# EasyEDA Pro project 无刷驱动电流闭环控制器.eprj

# Schematic Schematic1
Board Name: Board1; Create Date: 2024-09-18; Page Name: P1; Project Name: 无刷驱动电流闭环控制器; Schematic Name: Schematic1; Update Date: 2025-11-12; Company: 嘉立创EDA; Page Size: A4; Version: V1.0
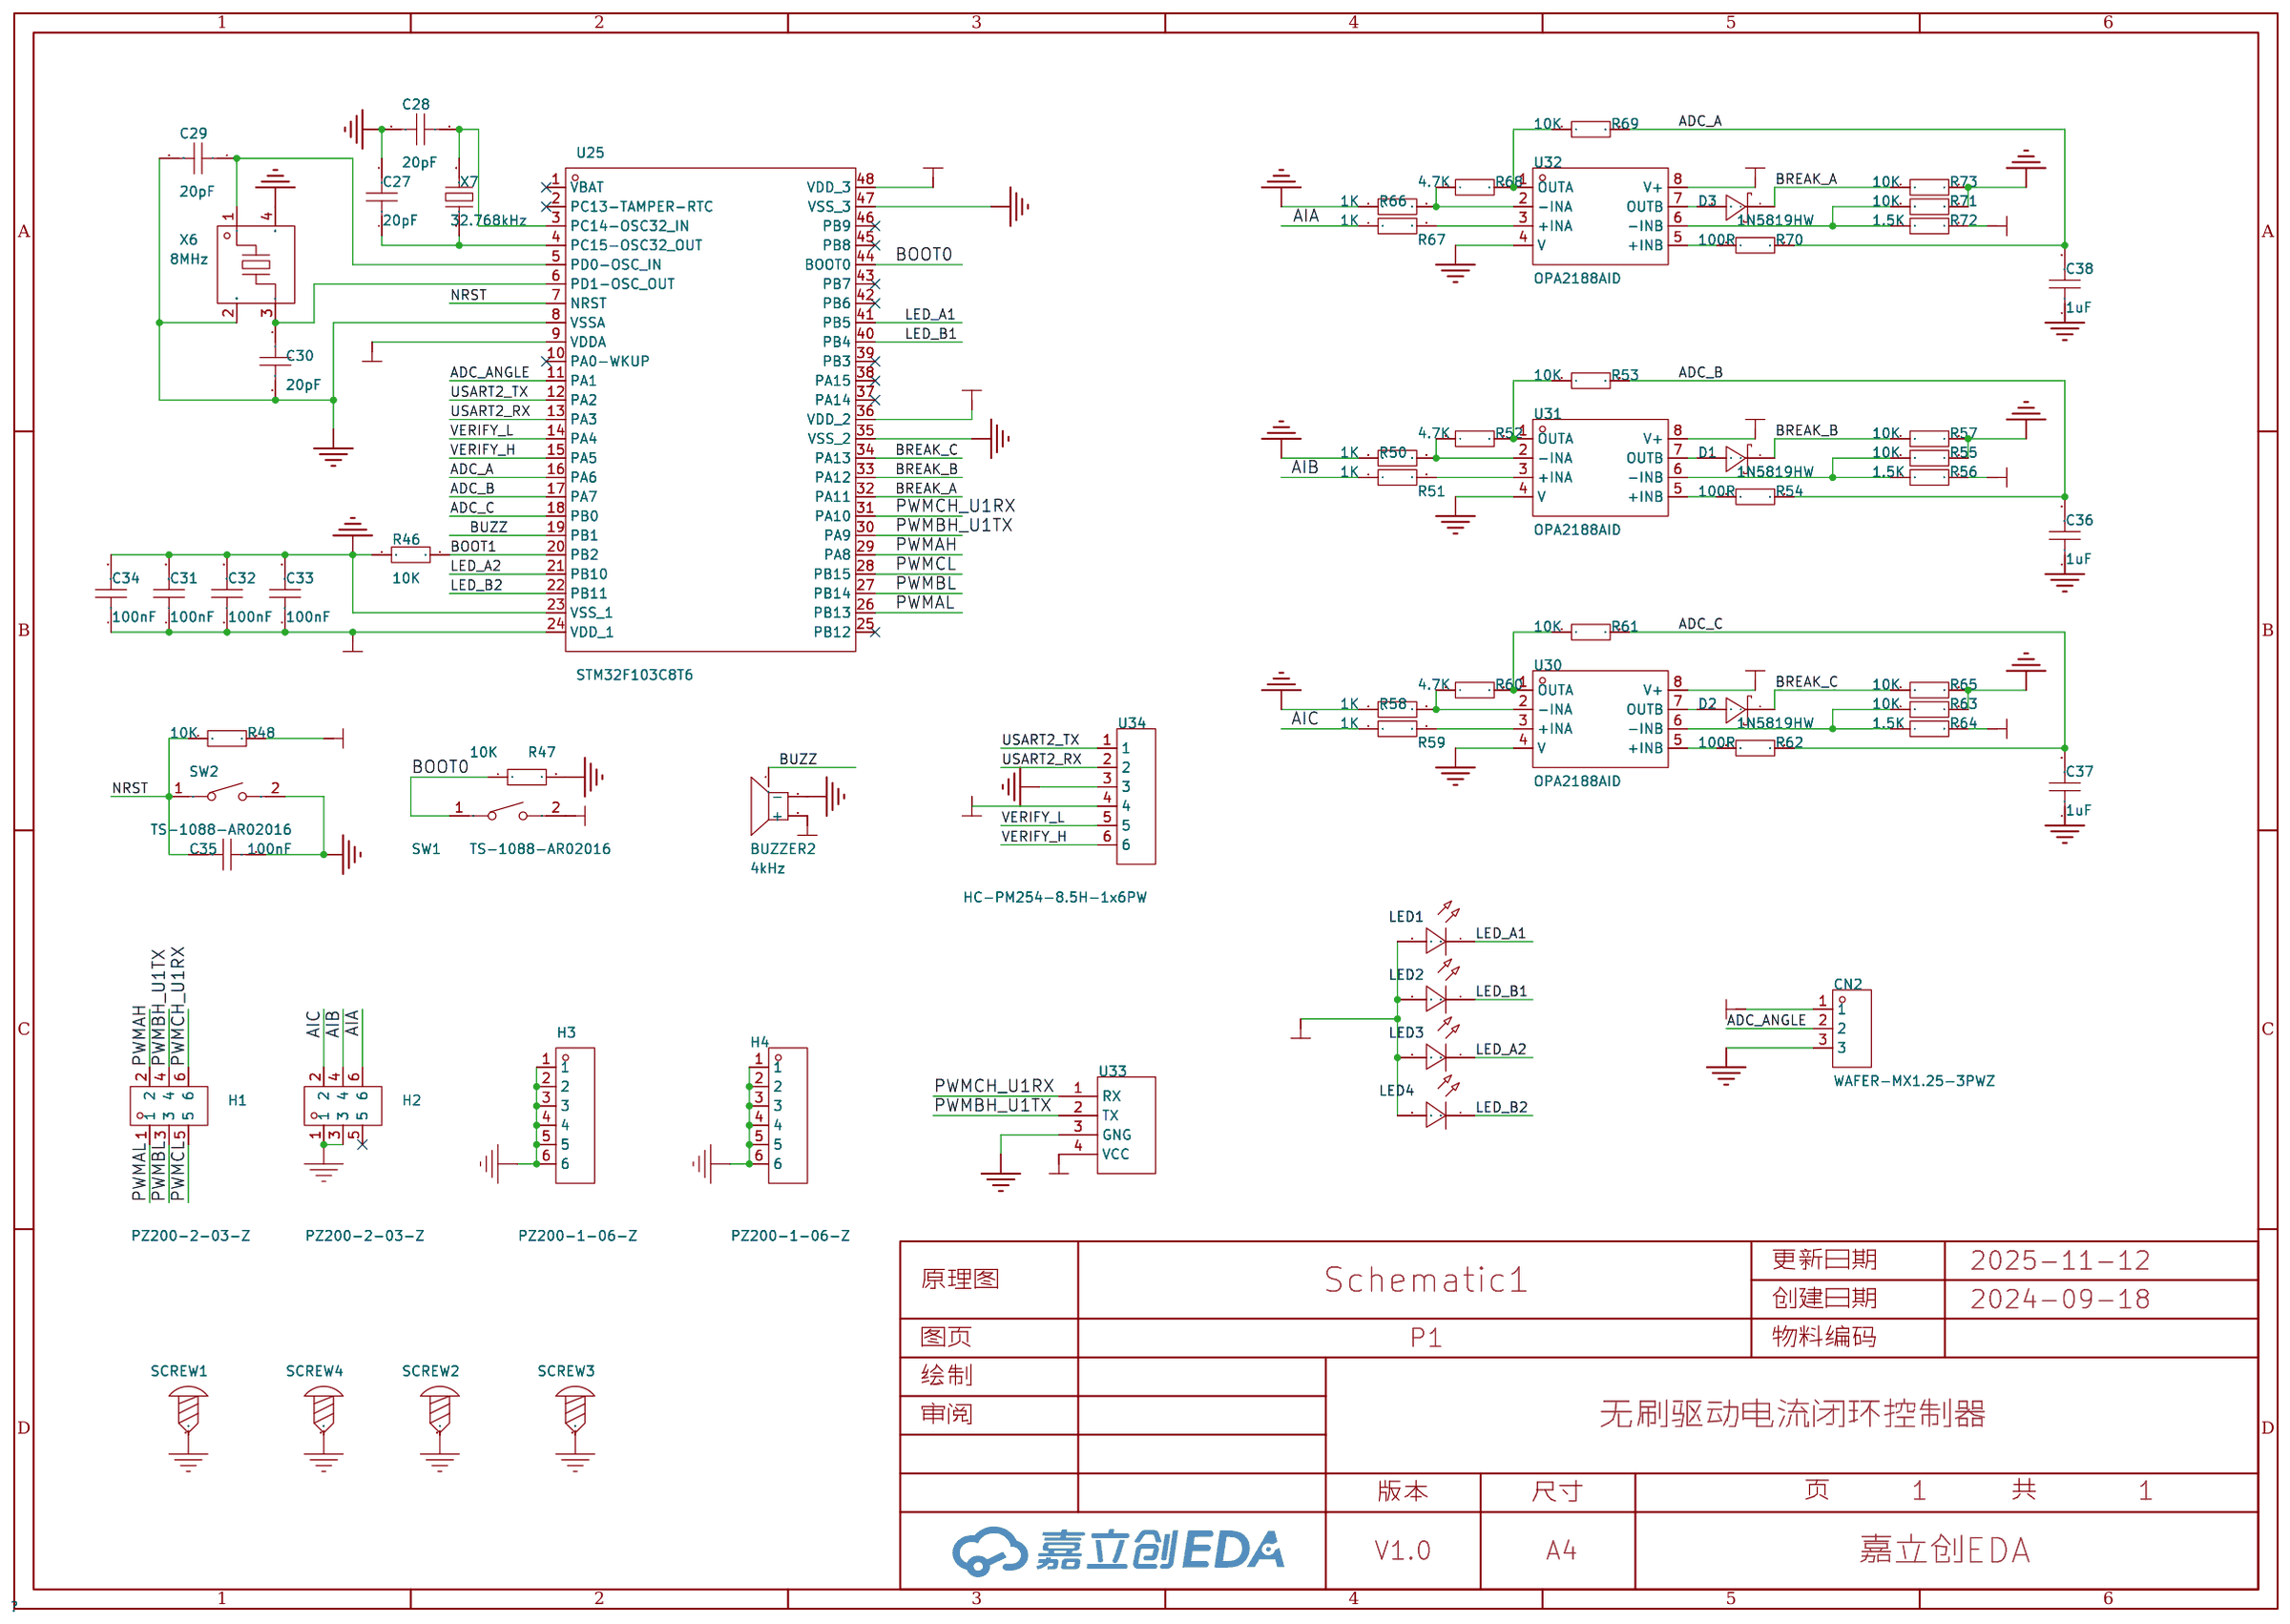
[diagram p0: schematic sheet]

## Parts
BUZZER2  4kHz  [BUZ-SMD_L5.0-W5.5-P4.60]
C27  20pF  [C0402]
C28  20pF  [C0402]
C29  20pF  [C0402]
C30  20pF  [C0402]
C31  100nF  [C0402]
C32  100nF  [C0402]
C33  100nF  [C0402]
C34  100nF  [C0402]
C35  100nF  [C0402]
C36  1uF  [C0402]
C37  1uF  [C0402]
C38  1uF  [C0402]
CN2  WAFER-MX1.25-3PWZ  [CONN-TH_3P-P1.25_XUNPU_WAFER-MX1.25-3PWZ]
D1  1N5819HW  [SOD-123_L2.7-W1.6-LS3.7-RD]
D2  1N5819HW  [SOD-123_L2.7-W1.6-LS3.7-RD]
D3  1N5819HW  [SOD-123_L2.7-W1.6-LS3.7-RD]
H1  PZ200-2-03-Z  [HDR-TH_6P-P2.00-V-M-R2-C3-S2.00]
H2  PZ200-2-03-Z  [HDR-TH_6P-P2.00-V-M-R2-C3-S2.00]
H3  PZ200-1-06-Z  [HDR-TH_6P-P2.00-V-M]
H4  PZ200-1-06-Z  [HDR-TH_6P-P2.00-V-M]
LED1  -  [LED_0402]
LED2  -  [LED_0402]
LED3  -  [LED_0402]
LED4  -  [LED_0402]
R46  10K  [R0402]
R47  10K  [R0402]
R48  10K  [R0402]
R50  1K  [R0402]
R51  1K  [R0402]
R52  4.7K  [R0402]
R53  10K  [R0402]
R54  100R  [R0402]
R55  10K  [R0402]
R56  1.5K  [R0402]
R57  10K  [R0402]
R58  1K  [R0402]
R59  1K  [R0402]
R60  4.7K  [R0402]
R61  10K  [R0402]
R62  100R  [R0402]
R63  10K  [R0402]
R64  1.5K  [R0402]
R65  10K  [R0402]
R66  1K  [R0402]
R67  1K  [R0402]
R68  4.7K  [R0402]
R69  10K  [R0402]
R70  100R  [R0402]
R71  10K  [R0402]
R72  1.5K  [R0402]
R73  10K  [R0402]
SCREW1  -  [M3_BD6.2]
SCREW2  -  [M3_BD6.2]
SCREW3  -  [M3_BD6.2]
SCREW4  -  [M3_BD6.2]
SW1  TS-1088-AR02016  [SW-SMD_L3.9-W3.0-P4.45]
SW2  TS-1088-AR02016  [SW-SMD_L3.9-W3.0-P4.45]
U25  STM32F103C8T6  [LQFP-48_L7.0-W7.0-P0.50-LS9.0-BL]
U30  OPA2188AID  [SOIC-8_L4.9-W3.9-P1.27-LS6.0-BL]
U31  OPA2188AID  [SOIC-8_L4.9-W3.9-P1.27-LS6.0-BL]
U32  OPA2188AID  [SOIC-8_L4.9-W3.9-P1.27-LS6.0-BL]
U33  -  [2.54串口烧录接口]
U34  HC-PM254-8.5H-1x6PW  [HDR-TH_HC-PM254-8.5H-1X6PW]
X6  8MHz  [OSC-SMD_4P-L3.2-W2.5-BL]
X7  32.768kHz  [OSC-SMD_L3.2-W1.5]

## Library data of the parts
BUZZER2 = MLT-5020: Supplier Part: C94598; Manufacturer: 华能; Supplier Footprint: SMD,5x5mm; JLCPCB Part Class: 扩展库; Datasheet: https://item.szlcsc.com/datasheet/MLT-5020/95796.html; Supplier: LCSC; Driver Circuitry: 无源(外部驱动); Technology: 电磁式; Length: 5.2mm; Width: 5.2mm; Height: 2.5mm
C27-C38 = CAP_0402: Supplier Footprint: 0402
CN2 = WAFER-MX1.25-3PWZ: 间距:1.25mm;插针结构:1x3P;排数:1;每排PIN数:3;公母:公型插针;安装方式:弯插;额定电流:1A;工作温度范围:-25℃~+85℃;; LCSC Part Name: 1.25mm 1x3P 弯插; Supplier Part: C3029405; Manufacturer: XUNPU(讯普); Supplier Footprint: 弯插,P=1.25mm; JLCPCB Part Class: 扩展库; Datasheet: https://atta.szlcsc.com/upload/public/pdf/source/20220527/86F7067D82B0B41BBD7A4713D9D828E9.pdf; Supplier: LCSC; Pitch: 1.25mm; Pins Structure: 1x3P; Number of Rows: 1; Number of PINs Per Row: 3; Gender: 公型插针; Mounting Style: 弯插; Current Rating (Max): 1A; Operating Temperature Range: -25℃~+85℃
D1-D3 = 1N5819HW-7-F: LCSC Part Name: 电压:40V 电流:1A; Supplier Part: C82544; Manufacturer: DIODES(美台); Supplier Footprint: SOD-123; JLCPCB Part Class: 扩展库; Datasheet: https://atta.szlcsc.com/upload/public/pdf/source/20161024/1477288459223.pdf; Supplier: LCSC; Forward Voltage (Vf@If): 450mV@1A; Reverse Voltage (Vr): 40V; Rectified Current: 1A; Reverse Leakage Current (Ir): 1mA@40V
H1 H2 = PZ200-2-03-Z: LCSC Part Name: 2x3P 间距:2mm 方针 直插; Supplier Part: C2905989; Manufacturer: HCTL(华灿天禄); Supplier Footprint: 插件,P=2mm; JLCPCB Part Class: 扩展库; Datasheet: https://atta.szlcsc.com/upload/public/pdf/source/20230609/E9B292E9F4F82C2859D5665FE1B563FB.pdf; Supplier: LCSC; Pin Structure: 2x3P; Pitch: 2mm; Row Spacing: 2mm; Circluar Pins/Square Pins: 方针; Mounting Type: 直插; Number of Rows: 双排; Number of Pins: 6P; Current Rating (Max): 1.5A; Length of Mating Pin: 4mm; Insulation Height: 2mm; Length of End Connection Pin: 2.8mm; Contact Material: 黄铜; Operating Temperature Range: -40℃~+105℃; Soldering Temperature(Max): 260℃@5S; Color: 黑色
H3 H4 = PZ200-1-06-Z: LCSC Part Name: 1x6P 间距:2mm 方针 直插; Supplier Part: C2905952; Manufacturer: HCTL(华灿天禄); Supplier Footprint: 插件,P=2mm; JLCPCB Part Class: 扩展库; Datasheet: https://atta.szlcsc.com/upload/public/pdf/source/20230609/0DA0371628951EEB327252501352EB23.pdf; Supplier: LCSC; Pin Structure: 1x6P; Pitch: 2mm; Circluar Pins/Square Pins: 方针; Mounting Type: 直插; Number of Rows: 单排; Number of Pins: 6P; Current Rating (Max): 1.5A; Length of Mating Pin: 4mm; Insulation Height: 2mm; Length of End Connection Pin: 2.8mm; Contact Material: 黄铜; Operating Temperature Range: -40℃~+105℃; Soldering Temperature(Max): 260℃@5S; Color: 黑色
LED1-LED4 = LED_0402-G: Supplier Footprint: 0402
R46-R48 R50-R73 = Res_0402: Supplier Footprint: 0402
SCREW1-SCREW4 = M3螺丝: Supplier Footprint: 插件
SW1 SW2 = TS-1088-AR02016: LCSC Part Name: 4*3*2mm 立贴 轻触开关; Supplier Part: C720477; Manufacturer: XUNPU(讯普); Supplier Footprint: SMD; JLCPCB Part Class: 扩展库; Datasheet: https://atta.szlcsc.com/upload/public/pdf/source/20200810/C720475_60D09DD6C54279ADDB2DC25100F1CC11.pdf; Supplier: LCSC; Circuit: 单刀单掷; Actuator Style: 圆形按钮; Operating Force: 160gf; Mounting Style: 立贴; Switch Length: 4mm; Switch Width: 3mm; Switch Height: 2mm; Strike Gundam: 不带; Contact Current: 50mA; Voltage Rating (DC): 12V; Insulation Resistance: 100MΩ; Actuator/Cap Color: 黑色; Pin Style: SMD接片; Mechanical Life: 10万次; Operating Temperature: -30℃~+80℃
U25 = STM32F103C8T6: LCSC Part Name: 主流增强型ARM Cortex-M3 MCU，具有64 KB Flash、72 MHz CPU、电机控制、USB和CAN; Supplier Part: C8734; Manufacturer: ST(意法半导体); Supplier Footprint: LQFP-48(7x7); JLCPCB Part Class: 扩展库; Datasheet: https://atta.szlcsc.com/upload/public/pdf/source/20220812/8363ACEC51AD55ECEB84799464F7CB85.pdf; Supplier: LCSC; CPU Core: ARM-M3; CPU Maximum Speed: 72MHz; Program Storage Size: 64KB; Program Memory Type: FLASH; GPIO Ports Number: 37; ADC (Bit): 12bit; Low Voltage Detection Threshold: 2V~3.6V
U30-U32 = OPA2188AID: Supplier Part: C2865878; Manufacturer: TI(德州仪器); Supplier Footprint: SOIC-8; JLCPCB Part Class: 扩展库; Datasheet: https://www.ti.com/cn/lit/gpn/opa2188; Supplier: LCSC; Number of Circuits: 双路; Gain Bandwidth Product(GBP): 2MHz; Current - Input Bias(Ib): 160pA; Voltage - Input Offset(Vos): 6uV; Slew Rate(SR): 0.8V/us; Operating Temperature: -40℃~+105℃
U33 = 2.54串口烧录接口
U34 = HC-PM254-8.5H-1x6PW: LCSC Part Name: 间距2.54mm 1x6Pin 弯插 PC3.2 PB10.2 H8.5; Supplier Part: C22436147; Manufacturer: HC(虹成电子); Supplier Footprint: 弯插,P=2.54mm; JLCPCB Part Class: 扩展库; Datasheet: https://item.szlcsc.com/datasheet/HC-PM254-8.5H-1x6PW/24066823.html; Supplier: LCSC; Holes Structure: 1x6P; Pitch: 2.54mm; Circular Hole / Square Hole: 方孔; Mounting Type: 弯插; Number of Rows: 单排; Number of Positions: 6P; Current Rating: 3A; Holes Direction: 侧面; Insulation Height: 2.5mm; Contact Material: 黄铜; Contact Plating: 金; Operating Temperature: -40℃~+105℃; PIN Length: 3mm
X6 = X32258MOB4SI: 晶振类型:贴片无源晶振;频率:8MHz;常温频差:±10ppm;负载电容:12pF;频率稳定度(全温):±30ppm;; LCSC Part Name: 8MHz ±10ppm 12pF; Supplier Part: C2682775; Manufacturer: YXC(扬兴晶振); Supplier Footprint: SMD3225-4P; JLCPCB Part Class: 扩展库; Datasheet: https://atta.szlcsc.com/upload/public/pdf/source/20210106/C2682774_0CD4FDA5D9DA3FBEEC23BD607A48E4B0.pdf; Supplier: LCSC; Crystal Type: 贴片无源晶振; Normal temperature Frequency Tolerance: ±10ppm; Load Capacitance: 12pF; Frequency Stability(Full temperature range): ±30ppm; Equivalent Series Resistance (ESR): 150Ω; Operating Temperature: -40℃~+85℃
X7 = X321532768KGD2SI: 频率:32.768kHz;负载电容:12.5pF;频率公差:±20ppm;; LCSC Part Name: 32.768kHz ±20ppm 12.5pF YST310S; Supplier Part: C620155; Manufacturer: YXC(扬兴晶振); Supplier Footprint: SMD3215-2P; Datasheet: https://atta.szlcsc.com/upload/public/pdf/source/20210329/C620155_E5A74FC0D27C5E9015A8D75DE9484FEA.pdf; Supplier: LCSC; Crystal Type: 贴片无源晶振; Load Capacitance: 12.5pF; Frequency Tolerance: ±20ppm; Operating Temperature: -40℃~+85℃

## Nets
3V3: BUZZER2.1(+) C31.1 C32.1 C33.1 C34.1 CN2.1 LED1.2(A) LED2.2(A) LED3.2(A) LED4.2(A) R48.2 R56.2 R64.2 R72.2 SW1.2 U25.9(VDDA) U25.24(VDD_1) U25.36(VDD_2) U25.48(VDD_3) U30.8(V+) U31.8(V+) U32.8(V+) U33.4(VCC) U34.4
GND: BUZZER2.2(-) C27.2 C28.2 C29.2 C30.2 C31.2 C32.2 C33.2 C34.2 C35.2 C36.1 C37.1 C38.1 CN2.3 H2.1 H2.3 H3.1 H3.2 H3.3 H3.4 H3.5 H3.6 H4.1 H4.2 H4.3 H4.4 H4.5 H4.6 R46.2 R47.2 R50.1 R55.2 R57.2 R58.1 R63.2 R65.2 R66.1 R71.2 R73.2 SCREW1.1 SCREW2.1 SCREW3.1 SCREW4.1 SW2.2 U25.8(VSSA) U25.23(VSS_1) U25.35(VSS_2) U25.47(VSS_3) U30.4(V) U31.4(V) U32.4(V) U33.3(GNG) U34.3 X6.2(GND) X6.4(GND)
ADC_A: C38.2 R69.2 R70.2 U25.16(PA6)
ADC_ANGLE: CN2.2 U25.11(PA1)
ADC_B: C36.2 R53.2 R54.2 U25.17(PA7)
ADC_C: C37.2 R61.2 R62.2 U25.18(PB0)
AIA: H2.6 R67.1
AIB: H2.4 R51.1
AIC: H2.2 R59.1
BOOT0: R47.1 SW1.1 U25.44(BOOT0)
BOOT1: R46.1 U25.20(PB2)
BREAK_A: D3.1(K) R73.1 U25.32(PA11)
BREAK_B: D1.1(K) R57.1 U25.33(PA12)
BREAK_C: D2.1(K) R65.1 U25.34(PA13)
BUZZ: BUZZER2.3(NC) U25.19(PB1)
LED_A1: LED1.1(C) U25.41(PB5)
LED_A2: LED3.1(C) U25.21(PB10)
LED_B1: LED2.1(C) U25.40(PB4)
LED_B2: LED4.1(C) U25.22(PB11)
NRST: C35.1 R48.1 SW2.1 U25.7(NRST)
PWMAH: H1.2 U25.29(PA8)
PWMAL: H1.1 U25.26(PB13)
PWMBH_U1TX: H1.4 U25.30(PA9) U33.2(TX)
PWMBL: H1.3 U25.27(PB14)
PWMCH_U1RX: H1.6 U25.31(PA10) U33.1(RX)
PWMCL: H1.5 U25.28(PB15)
USART2_RX: U25.13(PA3) U34.2
USART2_TX: U25.12(PA2) U34.1
VERIFY_H: U25.15(PA5) U34.6
VERIFY_L: U25.14(PA4) U34.5
$1N3127: C27.1 U25.4(PC15-OSC32_OUT) X7.1
$1N3130: C28.1 U25.3(PC14-OSC32_IN) X7.2
$1N3131: C29.1 U25.5(PD0-OSC_IN) X6.1
$1N3136: C30.1 U25.6(PD1-OSC_OUT) X6.3
$1N4212: R51.2 U31.3(+INA)
$1N4216: R50.2 R52.1 U31.2(-INA)
$1N4220: R52.2 R53.1 U31.1(OUTA)
$1N4300: R54.1 U31.5(+INB)
$1N4502: R55.1 R56.1 U31.6(-INB)
$1N4584: D1.2(A) U31.7(OUTB)
$1N5057: R59.2 U30.3(+INA)
$1N5059: R58.2 R60.1 U30.2(-INA)
$1N5062: R60.2 R61.1 U30.1(OUTA)
$1N5070: R62.1 U30.5(+INB)
$1N5074: R63.1 R64.1 U30.6(-INB)
$1N5079: D2.2(A) U30.7(OUTB)
$1N5487: R67.2 U32.3(+INA)
$1N5489: R66.2 R68.1 U32.2(-INA)
$1N5492: R68.2 R69.1 U32.1(OUTA)
$1N5500: R70.1 U32.5(+INB)
$1N5504: R71.1 R72.1 U32.6(-INB)
$1N5509: D3.2(A) U32.7(OUTB)

Not connected (* = marked no-connect by the designer): H2 5*; U25 1(VBAT)* 2(PC13-TAMPER-RTC)* 10(PA0-WKUP)* 25(PB12)* 37(PA14)* 38(PA15)* 39(PB3)* 42(PB6)* 43(PB7)* 45(PB8)* 46(PB9)*

# Board PCB1
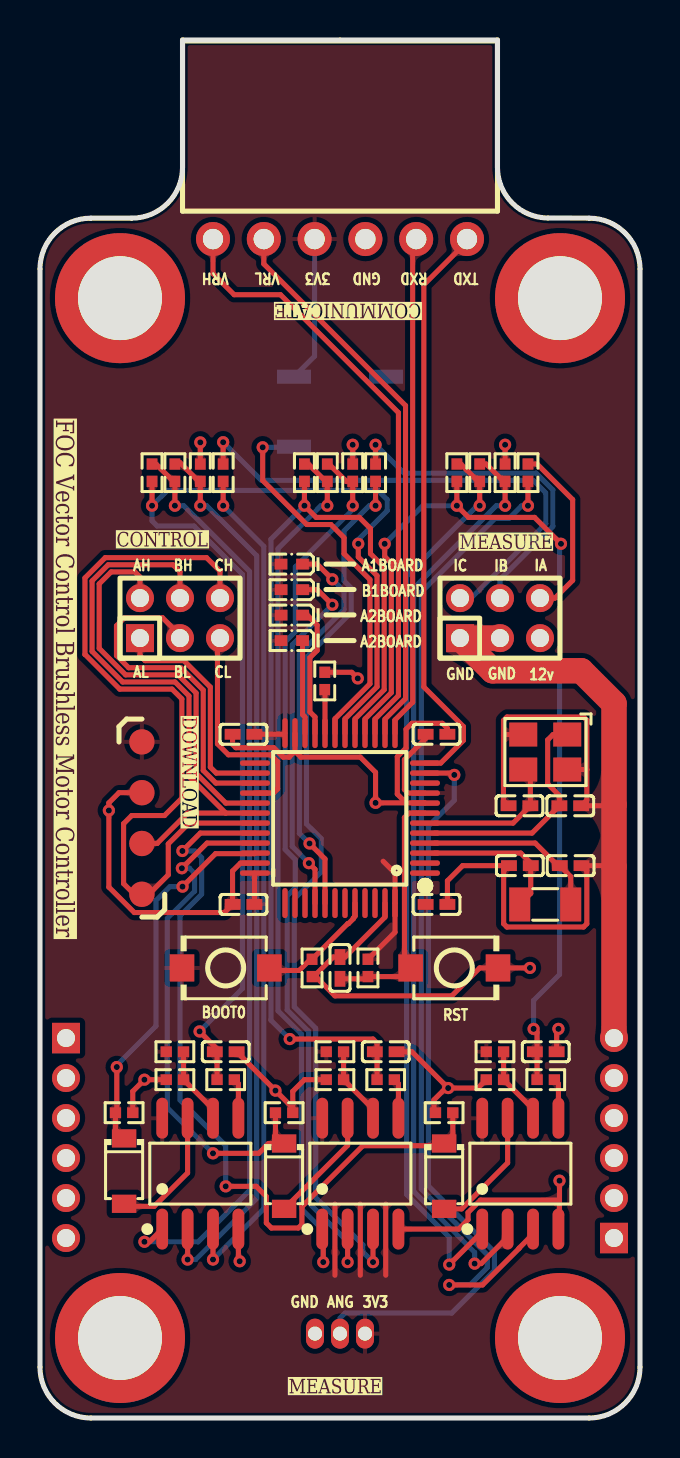
[diagram p1: board, top side]
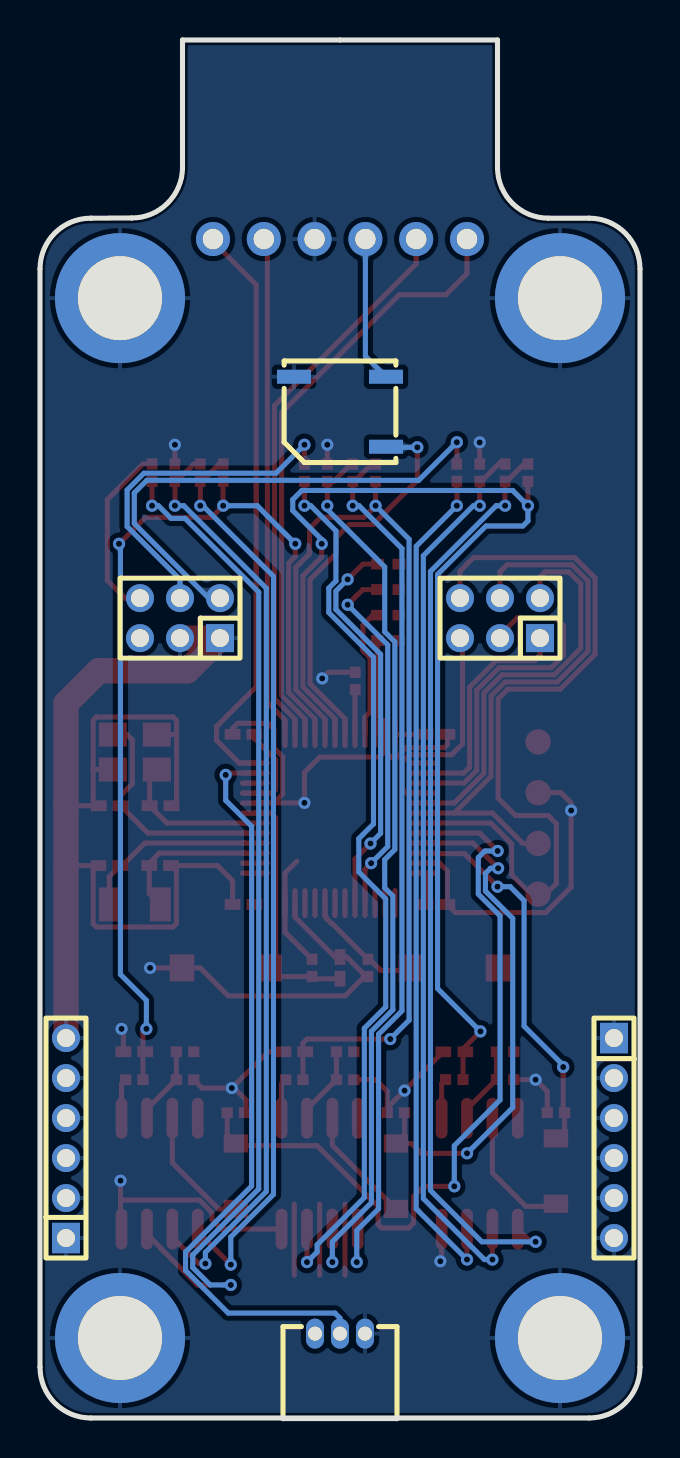
[diagram p2: board, bottom side, seen from below]

Outline 30 x 68.91 mm; copper layers: Top Layer, Bottom Layer. Coordinates in mm from the lower left corner of the outline.
Outline path: 0,57.46 0,2.54 arc(0.74,0.74) 2.54,0 27.46,0 arc(29.26,0.74) 30,2.54 30,57.46 arc(29.26,59.26) 27.46,60 25.41,60.01 arc(23.63,60.74) 22.87,62.52 22.87,68.91 7.13,68.91 7.13,62.53 arc(6.38,60.74) 4.59,60 2.54,60 arc(0.74,59.26) 0,57.46
Stack: Top Layer 0.035mm / Dielectric1 1.51mm FR4 er 4.5 / Bottom Layer 0.035mm

## Design rules (mm)
template: JLCPCB Capability(Two Layers Board)
spacing copperThickness1oz (default): track to track 0.102, other pairs 0.152 to 0.3
spacing copperThickness2oz: track to track 0.203, other pairs 0.152 to 0.3
track width copperThickness1oz (default): min 0.127, default 0.254, max 2.54
track width copperThickness2oz: min 0.203, default 0.254, max 2.54
differential pair differentialPair (default): width min 0.127, default 0.254, max 2.54; gap min 0.152, default 0.152
via viaSize (default): diameter min 0.5, default 0.61, max 10; hole min 0.3, default 0.305, max 6.3

## Placement (name value [footprint] x y rotation side)
BUZZER2  4kHz  [BUZ-SMD_L5.0-W5.5-P4.60]  15 50.32 0 bottom
C27  20pF  [C0402]  26.53 27.62 0 top
C28  20pF  [C0402]  23.99 27.62 180 top
C29  20pF  [C0402]  26.51 30.62 0 top
C30  20pF  [C0402]  23.97 30.62 180 top
C31  100nF  [C0402]  10.17 34.19 180 top
C32  100nF  [C0402]  19.83 34.19 0 top
C33  100nF  [C0402]  19.83 25.68 0 top
C34  100nF  [C0402]  10.17 25.68 180 top
C35  100nF  [C0402]  15 22.51 90 top
C36  1uF  [C0402]  17.29 18.32 180 top
C37  1uF  [C0402]  9.28 18.32 180 top
C38  1uF  [C0402]  25.29 18.32 180 top
CN2  WAFER-MX1.25-3PWZ  [CONN-TH_3P-P1.25_XUNPU_WAFER-MX1.25-3PWZ]  15 4.22 180 bottom
D1  1N5819HW  [SOD-123_L2.7-W1.6-LS3.7-RD]  12.21 12.09 270 top
D2  1N5819HW  [SOD-123_L2.7-W1.6-LS3.7-RD]  4.21 12.35 270 top
D3  1N5819HW  [SOD-123_L2.7-W1.6-LS3.7-RD]  20.21 12.09 270 top
H1  PZ200-2-03-Z  [HDR-TH_6P-P2.00-V-M-R2-C3-S2.00]  7 40 180 bottom
H2  PZ200-2-03-Z  [HDR-TH_6P-P2.00-V-M-R2-C3-S2.00]  23 40 180 bottom
H3  PZ200-1-06-Z  [HDR-TH_6P-P2.00-V-M]  1.3 14 270 bottom
H4  PZ200-1-06-Z  [HDR-TH_6P-P2.00-V-M]  28.7 14 90 bottom
LED1  -  [LED_0402]  12.59 42.7 180 top
LED2  -  [LED_0402]  12.59 41.42 180 top
LED3  -  [LED_0402]  12.59 40.15 180 top
LED4  -  [LED_0402]  12.59 38.88 180 top
R46  10K  [R0402]  14.24 36.86 90 top
R47  10K  [R0402]  13.6 22.51 270 top
R48  10K  [R0402]  16.4 22.51 90 top
R50  1K  [R0402]  15.63 47.27 270 top
R51  1K  [R0402]  16.78 47.27 270 top
R52  4.7K  [R0402]  14.37 47.27 270 top
R53  10K  [R0402]  13.22 47.27 270 top
R54  100R  [R0402]  17.29 16.92 180 top
R55  10K  [R0402]  14.75 16.92 180 top
R56  1.5K  [R0402]  14.75 18.32 180 top
R57  10K  [R0402]  12.21 15.27 0 top
R58  1K  [R0402]  8.01 47.27 270 top
R59  1K  [R0402]  9.16 47.27 270 top
R60  4.7K  [R0402]  6.75 47.27 270 top
R61  10K  [R0402]  5.6 47.27 270 top
R62  100R  [R0402]  9.28 16.92 180 top
R63  10K  [R0402]  6.75 16.92 180 top
R64  1.5K  [R0402]  6.75 18.32 180 top
R65  10K  [R0402]  4.21 15.27 0 top
R66  1K  [R0402]  23.25 47.27 270 top
R67  1K  [R0402]  24.4 47.27 270 top
R68  4.7K  [R0402]  21.99 47.27 270 top
R69  10K  [R0402]  20.84 47.27 270 top
R70  100R  [R0402]  25.29 16.92 180 top
R71  10K  [R0402]  22.75 16.92 180 top
R72  1.5K  [R0402]  22.75 18.32 180 top
R73  10K  [R0402]  20.21 15.27 180 top
SCREW1  -  [M3_BD6.2]  4 4 0 top
SCREW2  -  [M3_BD6.2]  26 56 0 top
SCREW3  -  [M3_BD6.2]  26 4 0 top
SCREW4  -  [M3_BD6.2]  4 56 0 top
SW1  TS-1088-AR02016  [SW-SMD_L3.9-W3.0-P4.45]  9.28 22.51 180 top
SW2  TS-1088-AR02016  [SW-SMD_L3.9-W3.0-P4.45]  20.72 22.51 0 top
U25  STM32F103C8T6  [LQFP-48_L7.0-W7.0-P0.50-LS9.0-BL]  15 30 90 top
U30  OPA2188AID  [SOIC-8_L4.9-W3.9-P1.27-LS6.0-BL]  8.01 12.22 0 top
U31  OPA2188AID  [SOIC-8_L4.9-W3.9-P1.27-LS6.0-BL]  16.02 12.22 0 top
U32  OPA2188AID  [SOIC-8_L4.9-W3.9-P1.27-LS6.0-BL]  24.02 12.22 0 top
U33  -  [2.54串口烧录接口]  5.09 30 90 top
U34  HC-PM254-8.5H-1x6PW  [HDR-TH_HC-PM254-8.5H-1X6PW]  15 58.96 180 top
X6  8MHz  [OSC-SMD_4P-L3.2-W2.5-BL]  25.26 33.3 180 top
X7  32.768kHz  [OSC-SMD_L3.2-W1.5]  25.26 25.68 180 top

## Footprints (pads in the part's own frame, mm; a bottom-side part is the same pattern mirrored in y, then rotated)
2.54串口烧录接口
  round 1.27 smd: 1(-3.81,0) 2(-1.27,0) 3(1.27,0) 4(3.81,0)
BUZ-SMD_L5.0-W5.5-P4.60
  rect 1.7x0.7 smd: 1(-2.3,-1.75) 2(2.3,-1.75) 3(-2.3,1.75)
C0402
  rect 0.79x0.54 smd: 1(-0.545,0) 2(0.545,0)
CONN-TH_3P-P1.25_XUNPU_WAFER-MX1.25-3PWZ
  oval 0.9x1.5 hole 0.7: 1(-1.25,0) 2(0,0) 3(1.25,0)
HDR-TH_6P-P2.00-V-M
  rect 1.524x1.4 hole 0.9: 1(-5,0)
  round 1.4 hole 0.9: 2(-3,0) 3(-1,0) 4(1,0) 5(3,0) 6(5,0)
HDR-TH_6P-P2.00-V-M-R2-C3-S2.00
  rect 1.4x1.4 hole 0.9: 1(2,-1)
  round 1.4 hole 0.9: 2(2,1) 3(0,-1) 4(0,1) 5(-2,-1) 6(-2,1)
HDR-TH_HC-PM254-8.5H-1X6PW
  round 1.7 hole 1.02: 1(-6.35,0) 2(-3.81,0) 3(-1.27,0) 4(1.27,0) 5(3.81,0) 6(6.35,0)
LED_0402
  rect 0.637x0.541 smd: 1(-0.538,0) 2(0.538,0)
LQFP-48_L7.0-W7.0-P0.50-LS9.0-BL
  oval 0.27x1.5 smd: 1(-2.75,-4.25) 2(-2.25,-4.25) 3(-1.75,-4.25) 4(-1.25,-4.25) 5(-0.75,-4.25) 6(-0.25,-4.25) 7(0.25,-4.25) 8(0.75,-4.25) 9(1.25,-4.25) 10(1.75,-4.25) 11(2.25,-4.25) 12(2.75,-4.25) 25(2.75,4.25) 26(2.25,4.25) 27(1.75,4.25) 28(1.25,4.25) 29(0.75,4.25) 30(0.25,4.25) 31(-0.25,4.25) 32(-0.75,4.25) 33(-1.25,4.25) 34(-1.75,4.25) 35(-2.25,4.25) 36(-2.75,4.25)
  oval 1.5x0.27 smd: 13(4.25,-2.75) 14(4.25,-2.25) 15(4.25,-1.75) 16(4.25,-1.25) 17(4.25,-0.75) 18(4.25,-0.25) 19(4.25,0.25) 20(4.25,0.75) 21(4.25,1.25) 22(4.25,1.75) 23(4.25,2.25) 24(4.25,2.75) 37(-4.25,2.75) 38(-4.25,2.25) 39(-4.25,1.75) 40(-4.25,1.25) 41(-4.25,0.75) 42(-4.25,0.25) 43(-4.25,-0.25) 44(-4.25,-0.75) 45(-4.25,-1.25) 46(-4.25,-1.75) 47(-4.25,-2.25) 48(-4.25,-2.75)
M3_BD6.2
  round 6.5 hole 4.2: 1(0,0)
OSC-SMD_4P-L3.2-W2.5-BL
  rect 1.4x1.2 smd: 1(-1.1,-0.875) 2(1.1,-0.875) 3(1.1,0.875) 4(-1.1,0.875)
OSC-SMD_L3.2-W1.5
  rect 1.05x1.7 smd: 1(-1.275,0) 2(1.275,0)
R0402
  rect 0.566x0.54 smd: 1(-0.433,0) 2(0.433,0)
SOD-123_L2.7-W1.6-LS3.7-RD
  rect 0.91x1.22 smd: 1(-1.635,0) 2(1.635,0)
SOIC-8_L4.9-W3.9-P1.27-LS6.0-BL
  oval 0.588x2.045 smd: 1(-1.905,-2.772) 2(-0.635,-2.772) 3(0.635,-2.772) 4(1.905,-2.772) 5(1.905,2.772) 6(0.635,2.772) 7(-0.635,2.772) 8(-1.905,2.772)
SW-SMD_L3.9-W3.0-P4.45
  rect 1.23x1.36 smd: 1(-2.185,0) 2(2.185,0)

## Nets
As in the schematic.

Pads without a net: H2 5; U25 1 2 10 25 37 38 39 42 43 45 46

## Via types
v1: diameter 0.61, hole 0.305, Top Layer to Bottom Layer, 54 vias

## Routing (per net, layer and track width the routed paths; a pad name or vN(x,y) marks a point on that pad's centre or on a via; arc(x,y) is an arc through that point)
3V3: length 31.2
  Top Layer w0.254: 14.75,7.14 14.75,10.7 ; 10.72,27.25 10.72,25.69 C34.1 ; 19.21,25.75 C33.1 ; U25.24 12.19,34.19 C31.1 ; 16.02,7.14 16.02,10.7 ; 17.29,7.14 17.29,10.7 ; 17.16,27.84 17.75,27.25 U25.48 17.75,24.29 R48.2 ; U25.9 18.4,31.25 18.22,31.43 18.22,32.92 19.28,33.98 C32.1
  Bottom Layer w0.254: BUZZER2.1 13.73,53.1 U34.4
GND: length 150.6
  Top Layer w0.254: 10.72,27.75 10.02,27.75 9.63,27.35 9.63,25.68 9.22,25.28 4.72,25.28 3.44,26.55 v1(3.44,30.38) 3.44,30.76 3.95,31.27 5.5,31.27 ; 13.83,22.07 13.83,22.03 14.75,21.11 20.59,21.11 21.99,22.51 SW2.2 v1(24.5,22.51) ; 13.83,22.07 R47.2 ; 13.83,22.07 13.83,22.22 14.66,23.05 C35.2 15.25,23.05 17.25,25.05 U25.47 ; 23.17,34.12 23.23,34.18 X6.2 ; 23.17,34.12 23.17,34.88 23.35,35.06 27.18,35.06 27.34,34.89 27.34,32.42 ; 23.17,34.12 23.17,30.87 C30.2 ; v1(15.89,36.98) 15.58,37.29 R46.2 ; R71.2 21.9,16.5 v1(20.41,16.5) ; R65.2 4.64,16.34 v1(5.22,16.92) R63.2 ; U31.4 20.93,9.45 21.4,9.92 21.4,10.28 22.02,10.9 25.97,10.9 ; v1(20.41,16.5) 20.29,16.5 19.7,15.91 19.7,15.34 R73.2 ; v1(20.41,16.5) 18.59,18.32 C36.1 ; 20.37,34.19 20.37,34.49 20.12,34.74 18.6,34.74 18.3,34.44 18.3,33.51 17.87,33.07 17.87,31.2 18.3,30.76 ; 25.97,10.9 25.97,9.5 U32.4 ; 25.97,10.9 v1(25.97,11.87) ; 10,7.83 9.92,7.9 U30.4 ; 12.75,33.34 12.46,33.05 12.16,33.05 11.68,33.52 9.79,33.52 9.63,33.68 9.63,34.19 ; 12.75,33.34 U25.23 ; 12.75,33.34 13.04,33.05 16.02,33.05 16.78,32.29 v1(16.78,30.76) 18.3,30.76 ; v1(25.92,19.46) 25.83,19.37 C38.1 ; 28.7,30.67 28.64,30.62 C29.2 27.34,30.9 27.34,32.42 ; 27.34,32.42 27.34,32.43 X6.4 ; 18.3,30.76 19.24,30.76 U25.8 ; 28.7,27.57 28.65,27.62 C27.2 27.34,27.36 27.34,24.72 27.18,24.55 23.35,24.55 23.18,24.72 23.18,27.36 C28.2 21.13,27.62 20.37,26.86 20.37,25.68 ; 12.64,15.51 12.64,16.34 13.22,16.92 14.31,16.92 ; 12.64,15.51 v1(11.77,16.37) C37.1 ; 12.64,15.51 12.64,15.27 ; R66.1 v1(23.25,48.67) ; 8.01,47.7 v1(8.01,48.79) ; v1(15.63,48.67) 15.63,47.7
  Top Layer w1.27: H2.3 H2.1 22.63,37.37 27.06,37.37 28.7,35.73 H4.6
  vias: v1(9.98,7.84)
ADC_A: length 49.2
  Top Layer w0.254: U25.16 16.25,34.96 17.56,36.27 17.56,42.75 17.24,43.08 v1(17.24,43.72) ; R69.2 v1(20.84,45.62) 21.43,45.04 24.73,45.04 v1(26.05,43.72) ; v1(24.68,19.46) 24.85,19.28 R70.2
  Bottom Layer w0.254: v1(26.05,43.72) 25.98,43.65 25.98,22.18 24.68,20.88 v1(24.68,19.46) ; v1(17.24,43.72) 19.14,45.62 v1(20.84,45.62)
ADC_ANGLE: length 37.7
  Top Layer w0.254: U25.11 20.62,32.25 v1(20.72,32.16)
  Bottom Layer w0.254: v1(20.72,32.16) 20.72,30.89 19.42,29.59 19.42,11.6 22.72,8.3 22.72,7.38 20.59,5.25 15.25,5.25 15,4.99 CN2.2
ADC_B: length 50.1
  Top Layer w0.254: v1(12.49,18.95) 16.65,18.95 16.85,18.75 R54.2 ; U25.17 15.75,34.96 17.21,36.42 17.21,42.53 16.52,43.22 16.52,44.48 15.97,45.04 13.81,45.04 v1(13.22,45.62) R53.2
  Bottom Layer w0.254: v1(12.49,18.95) 11.54,19.89 11.54,43.94 v1(13.22,45.62)
ADC_C: length 59.7
  Top Layer w0.254: R62.2 8.85,18.46 v1(7.98,19.33) ; R61.2 v1(5.6,45.62) ; v1(15.91,43.72) 15.91,43.06 16.85,42.12 16.85,36.57 15.25,34.96 U25.18
  Bottom Layer w0.254: v1(7.98,19.33) 10.12,21.48 10.12,42.18 7.7,44.61 5.86,44.61 5.6,44.86 v1(5.6,45.62) 6.36,46.38 16.91,46.38 17.36,45.93 17.36,45.38 15.91,43.93 v1(15.91,43.72)
AIA: length 9
  Top Layer w0.254: H2.6 25.75,41 26.63,41.89 26.63,45.93 24.85,47.71 R67.1
AIB: length 17.3
  Top Layer w0.254: 16.78,47.7 v1(16.78,48.67)
  Bottom Layer w0.254: H2.4 23,41.94 25.64,44.58 25.64,46.41 24.8,47.25 18.2,47.25 v1(16.78,48.67)
AIC: length 25.6
  Top Layer w0.254: 9.16,47.7 v1(9.16,48.8)
  Bottom Layer w0.254: v1(9.16,48.8) 11.06,46.89 24.66,46.89 25.29,46.26 25.29,44.73 21.56,41 H2.2
BOOT0: length 6.2
  Top Layer w0.254: U25.44 15.75,25.09 15.66,25 15.66,24.96 15.42,24.72 15.38,24.72 R47.1 13.56,22.98 12.96,22.38 11.6,22.38 SW1.1
BOOT1: length 2.2
  Top Layer w0.254: R46.1 14.25,36.41 U25.20
BREAK_A: length 39.5
  Top Layer w0.254: U25.32 8.01,29.25 v1(7.12,28.36) ; R73.1 20.64,14.16 D3.1 20.1,13.62 16.14,13.62 13.09,10.57 13.09,9.68 12.92,9.5 11.57,9.5 11.32,9.75 11.32,11.08 10.81,11.59 v1(9.28,11.59)
  Bottom Layer w0.254: v1(9.28,11.59) 9.28,13.62 7,15.9 7,25.11 8.09,26.2 8.09,28.03 7.75,28.36 v1(7.12,28.36)
BREAK_B: length 25.9
  Top Layer w0.254: v1(7.09,27.49) 8.35,28.75 U25.33 ; R57.1 11.77,14.16 D1.1 11.43,13.73 10.94,13.24 v1(8.65,13.24)
  Bottom Layer w0.254: v1(8.65,13.24) 6.36,15.52 6.36,24.98 7.73,26.35 7.73,27.24 7.47,27.49 v1(7.09,27.49)
BREAK_C: length 18.8
  Top Layer w0.254: D2.1 3.77,14.42 R65.1 3.84,15.34 v1(3.84,17.55) ; U25.34 10.72,28.22 8.78,28.22 v1(7.13,26.57)
  Bottom Layer w0.254: v1(7.13,26.57) 6.49,26.57 5.8,25.88 5.8,19.6 3.84,17.64 v1(3.84,17.55)
BUZZ: length 19.5
  Top Layer w0.254: U25.19 14.75,34.97 16.5,36.71 16.5,41.93 15.2,43.22 15.2,44.02 14.54,44.68 13.34,44.68 11.13,46.88 v1(11.13,48.54)
  Bottom Layer w0.254: BUZZER2.3 12.67,48.54 v1(11.13,48.54)
LED_A1: length 19.7
  Top Layer w0.254: v1(13.48,28.73) 14.25,27.96 U25.41 ; LED1.1 13.86,42.7 v1(14.62,41.94)
  Bottom Layer w0.254: v1(14.62,41.94) 15.2,41.35 15.2,40.43 12.97,38.19 12.97,29.24 v1(13.48,28.73)
LED_A2: length 6.6
  Top Layer w0.254: U25.21 13.75,35.06 13.5,35.31 13.5,38.02 13.86,38.38 13.86,39.65 13.36,40.15 LED3.1
LED_B1: length 18
  Top Layer w0.254: U25.40 13.75,27.44 v1(13.44,27.75) ; v1(14.62,40.67) 13.87,41.42 LED2.1
  Bottom Layer w0.254: v1(13.44,27.75) 12.61,28.58 12.61,38.66 v1(14.62,40.67)
LED_B2: length 4.7
  Top Layer w0.254: U25.22 13.25,35.05 13.13,35.17 LED4.1
NRST: length 12.3
  Top Layer w0.254: C35.1 16.28,21.96 R48.1 18.1,22.07 18.22,22.2 18.22,30.03 18.44,30.25 U25.7
PWMAH: length 20
  Top Layer w0.254: 10.72,30.75 9.29,30.75 7.81,32.23 7.81,36.26 6.9,37.16 4.28,37.16 2.96,38.48 2.96,41.71 3.56,42.31 4.75,42.31 5,42.06 H1.2
PWMAL: length 11.4
  Top Layer w0.254: 10.72,32.25 8.81,32.25 8.52,32.55 8.52,36.55 7.19,37.87 5.25,37.87 5,38.13 H1.1
PWMBH_U1TX: length 28
  Top Layer w0.254: 9.29,30.25 7.38,30.25 5.86,28.73 5.5,28.73 ; 9.29,30.25 U25.30 ; 9.29,30.25 7.45,32.09 7.45,36.11 6.75,36.81 4.13,36.81 2.6,38.34 2.6,41.86 3.41,42.67 6.65,42.67 7,42.32 H1.4
PWMBL: length 17.2
  Top Layer w0.254: 10.72,31.75 8.79,31.75 8.16,32.38 8.16,36.4 7.05,37.52 4.43,37.52 3.82,38.13 3.82,39.62 4.23,40.02 6.12,40.02 7,39.14 H1.3
PWMCH_U1RX: length 39
  Top Layer w0.254: U25.31 7.45,29.75 6.41,28.71 6.41,27.16 5.44,26.19 4.71,26.19 4.18,26.72 4.18,29.72 4.59,30.13 6.22,30.13 7.09,31 7.09,35.96 6.6,36.45 3.99,36.45 2.26,38.18 2.25,38.18 2.25,42.01 3.26,43.02 8.33,43.02 9,42.35 H1.6
PWMCL: length 11.3
  Top Layer w0.254: H1.5 9,38.87 8.87,38.75 8.87,33.71 9.42,33.16 11.54,33.16 11.88,32.82 11.88,31.45 11.68,31.25 10.72,31.25
USART2_RX: length 25.1
  Top Layer w0.254: U25.13 17.75,34.91 18.63,35.79 18.63,58.78 U34.2
USART2_TX: length 29.2
  Top Layer w0.254: U34.1 21.35,58.83 19.19,56.67 19.19,36.56 21.17,34.58 21.17,33.89 20.04,32.75 U25.12
VERIFY_H: length 30.4
  Top Layer w0.254: U34.6 8.65,57.23 9.71,56.17 12.02,56.17 17.92,50.28 17.92,36.12 16.75,34.95 U25.15
VERIFY_L: length 28.1
  Top Layer w0.254: U25.14 17.25,34.95 18.28,35.98 18.28,50.63 11.19,57.71 U34.5
$1N3127: length 8.8
  Top Layer w0.254: C27.1 26.54,27.07 X7.1 ; 25.99,27.75 25.76,27.75 24.76,28.75 19.73,28.75
$1N3130: length 7.2
  Top Layer w0.254: 19.73,28.25 24.04,28.25 24.54,27.75 ; C28.1 24.54,26.23 X7.2
$1N3131: length 11.4
  Top Layer w0.254: 19.73,29.25 24.6,29.25 C29.1 25.97,31.13 25.38,31.71 25.38,33.91 25.65,34.18 X6.1
$1N3136: length 7.1
  Top Layer w0.254: X6.3 24.52,32.07 C30.1 23.65,29.75 19.73,29.75
$1N4212: length 45.1
  Top Layer w0.254: R51.2 v1(16.78,45.62) ; 16.65,9.45 v1(16.65,7.8)
  Bottom Layer w0.254: v1(16.78,45.62) 16.46,45.62 15.2,44.36 15.2,41.86 15.56,41.5 15.56,40.28 13.32,38.05 13.32,29.71 14.06,28.97 14.06,27.3 12.71,25.96 12.71,20.56 13.78,19.49 13.78,11.02 16.14,8.66 16.14,8.3 v1(16.65,7.8)
$1N4216: length 45.4
  Top Layer w0.254: v1(15.63,45.62) R50.2 15.31,46.84 14.45,47.7 14.37,47.7 ; U31.2 v1(15.38,7.8)
  Bottom Layer w0.254: v1(15.38,7.8) 15.38,8.82 13.43,10.77 13.43,19.34 12.36,20.41 12.36,26.11 12.76,26.51 12.76,27.92 12.26,28.43 12.26,38.81 12.76,39.32 12.76,42.56 15.63,45.43 v1(15.63,45.62)
$1N4220: length 44.4
  Top Layer w0.254: 13.22,47.7 13.42,47.7 14.32,46.8 R52.2 v1(14.37,45.62) ; U31.1 14.16,9.4 v1(14.16,7.8)
  Bottom Layer w0.254: v1(14.37,45.62) 14.05,45.62 11.9,43.47 11.9,20.36 13.07,19.19 13.07,10.47 14.16,9.38 v1(14.16,7.8)
$1N4300: length 2
  Top Layer w0.254: R54.1 17.92,16.72 U31.5
$1N4502: length 3.9
  Top Layer w0.254: R56.1 R55.1 16.65,15.45 16.65,14.99
$1N4584: length 5.8
  Top Layer w0.254: D1.2 15.38,13.63 U31.7
$1N5057: length 42.3
  Top Layer w0.254: R59.2 v1(9.16,45.62) ; U30.3 v1(8.65,7.92)
  Bottom Layer w0.254: v1(9.16,45.62) 11.19,43.59 11.19,10.46 v1(8.65,7.92)
$1N5059: length 45.2
  Top Layer w0.254: v1(7.38,7.92) U30.2 ; 6.75,47.7 6.82,47.78 6.99,47.78 7.93,46.84 R58.2 v1(8.01,45.62)
  Bottom Layer w0.254: v1(8.01,45.62) 8.33,45.62 10.83,43.12 10.83,10.97 7.78,7.92 v1(7.38,7.92)
$1N5062: length 46.3
  Top Layer w0.254: v1(6.75,45.62) R60.2 6.7,46.8 5.8,47.7 5.6,47.7 ; v1(5.22,8.81) 5.47,8.81 U30.1
  Bottom Layer w0.254: v1(5.22,8.81) 7.91,8.81 10.48,11.38 10.48,42.33 7.19,45.62 v1(6.75,45.62)
$1N5070: length 2
  Top Layer w0.254: R62.1 9.92,16.72 U30.5
$1N5074: length 3.9
  Top Layer w0.254: U30.6 8.65,15.45 R63.1 R64.1
$1N5079: length 6.6
  Top Layer w0.254: U30.7 7.38,12.26 5.71,10.59 4.21,10.59
$1N5487: length 51.3
  Top Layer w0.254: U32.3 24.65,9.19 23.96,8.5 23.96,8.48 22.13,6.65 v1(20.46,6.65) ; R67.2 v1(24.4,45.62)
  Bottom Layer w0.254: v1(24.4,45.62) 24.08,45.62 23.45,44.99 22.75,44.99 19.06,41.3 19.06,11.45 22.37,8.15 22.37,7.53 21.49,6.65 v1(20.46,6.65)
$1N5489: length 46.8
  Top Layer w0.254: v1(23.25,45.62) R66.2 23.21,46.8 22.31,47.71 R68.1 ; v1(21.73,7.72) 22.06,7.72 23.38,9.04 U32.2
  Bottom Layer w0.254: v1(23.25,45.62) 22.81,45.62 18.68,41.49 18.68,11.33 21.73,8.28 v1(21.73,7.72)
$1N5492: length 45.6
  Top Layer w0.254: U32.1 22.11,9.32 v1(20.46,7.67) ; R69.1 21.04,47.71 21.94,46.8 R68.2 v1(21.99,45.62)
  Bottom Layer w0.254: v1(21.99,45.62) 21.86,45.62 18.33,42.09 18.33,11.18 20.46,9.05 v1(20.46,7.67)
$1N5500: length 2
  Top Layer w0.254: R70.1 25.92,16.72 U32.5
$1N5504: length 3.9
  Top Layer w0.254: U32.6 24.65,15.45 R71.1 R72.1
$1N5509: length 6.4
  Top Layer w0.254: U32.7 23.38,12.76 21.08,10.46 D3.2

## Copper pours and planes (outline as drawn; the poured copper is in the pictures)
3V3 on Top Layer: 0,68.91 30,68.91 30,0 0,0
GND on Bottom Layer: 0,68.91 30,68.91 30,0 0,0

Small or netless copper shapes (teardrops, artwork), in the pictures only: 208 on Top Layer, 35 on Bottom Layer

## Text on the board
Top Silkscreen Layer: AH | AL | BH | BL | CH | CL | VRH | VRL | 3V3 | GND | RXD | TXD | BOOT0 | ANG | A2BOARD | A1BOARD | B1BOARD | RST | IC | IB | 12v | IA | CONTROL | COMMUNICATE | MEASURE | DOWNLOAD | FOC Vector Control Brushless Motor Controller
